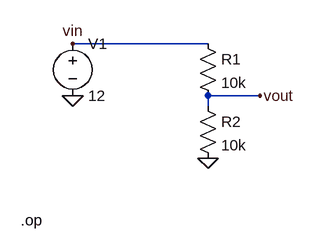
[diagram p0: schematic resistor_divider_spec.asc]
resistor_divider_spec.asc, the LTspice schematic file:
Version 4
SHEET 1 1000 700
WIRE 128 176 336 176
WIRE 336 256 336 272
WIRE 336 256 416 256
FLAG 128 176 vin
FLAG 416 256 vout
FLAG 128 256 0
FLAG 336 352 0
SYMBOL voltage 128 160 R0
SYMATTR InstName V1
SYMATTR Value 12
SYMBOL res 320 160 R0
SYMATTR InstName R1
SYMATTR Value 10k
SYMBOL res 320 256 R0
SYMATTR InstName R2
SYMATTR Value 10k
TEXT 48 448 Left 2 !.op

The netlist it stands for:
* resistor_divider_spec.asc
V1 vin 0 12
R1 vin vout 10k
R2 vout 0 10k
.op
.backanno
.end